# EAGLE design rev4 (EAGLE 6.6.0)
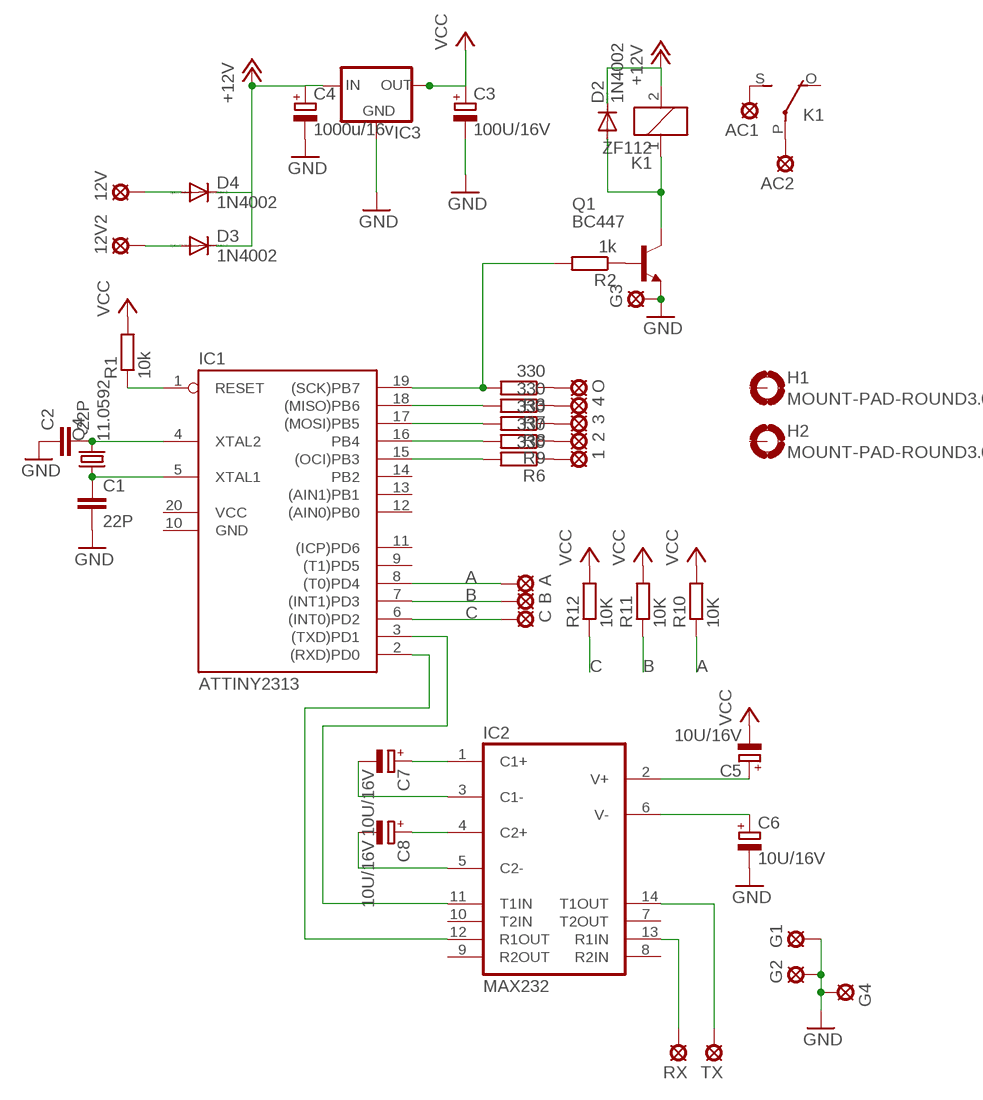
[diagram p0: schematic, sheet 1]

## Parts
1  MCS10B  [MCS10B]
2  MCS10B  [MCS10B]
3  MCS10B  [MCS10B]
4  MCS10B  [MCS10B]
12V  MCS10B  [MCS10B]
12V2  MCS10B  [MCS10B]
A  MCS10B  [MCS10B]
AC1  MCS10B  [MCS10B]
AC2  MCS10B  [MCS10B]
B  MCS10B  [MCS10B]
C  MCS10B  [MCS10B]
C1  22P  C-EU025-025X050  [C025-025X050]
C2  22P  C-EU025-025X050  [C025-025X050]
C3  100U/16V  CPOL-EUE2.5-5  [E2,5-5]
C4  1000u/16v  CPOL-EUE5-6  [E5-6]
C5  10U/16V  CPOL-EUE2.5-5  [E2,5-5]
C6  10U/16V  CPOL-EUE2.5-5  [E2,5-5]
C7  10U/16V  CPOL-EUE2.5-5  [E2,5-5]
C8  10U/16V  CPOL-EUE2.5-5  [E2,5-5]
D2  1N4002  1N4148DO35-7  [DO35-7]
D3  1N4002  1N4148DO35-7  [DO35-7]
D4  1N4002  1N4148DO35-7  [DO35-7]
G1  MCS10B  [MCS10B]
G2  MCS10B  [MCS10B]
G3  MCS10B  [MCS10B]
G4  MCS10B  [MCS10B]
H1  MOUNT-PAD-ROUND3.0  [3,0-PAD]
H2  MOUNT-PAD-ROUND3.0  [3,0-PAD]
IC1  ATTINY2313  AT90S2313P  [DIL20]
IC2  MAX232  [DIL16]
IC3  78XXS  [78XXS]
K1  ZF112  [ZF112]
O  MCS10B  [MCS10B]
Q1  BC447  [TO92-EBC]
Q4  11.0592  CRYSTALHC49S  [HC49/S]
R1  10k  R-EU_0207/7  [0207/7]
R2  1k  R-EU_0207/7  [0207/7]
R3  330  R-EU_0207/7  [0207/7]
R6  330  R-EU_0207/7  [0207/7]
R7  330  R-EU_0207/7  [0207/7]
R8  330  R-EU_0207/7  [0207/7]
R9  330  R-EU_0207/7  [0207/7]
R10  10K  R-EU_0207/7  [0207/7]
R11  10K  R-EU_0207/7  [0207/7]
R12  10K  R-EU_0207/7  [0207/7]
RX  MCS10B  [MCS10B]
TX  MCS10B  [MCS10B]

## Nets
+12V: C4.+ D2.C D3.C D4.C IC3.IN K1.2
A: A.MP IC1.8((T0)PD4) R10.1
B: B.MP IC1.7((INT1)PD3) R11.1
C: C.MP IC1.6((INT0)PD2) R12.1
GND: C1.2 C2.1 C3.- C4.- C6.- G1.MP G2.MP G3.MP G4.MP IC3.GND Q1.E
MISO: IC1.18((MISO)PB6) R7.2
MOSI: IC1.17((MOSI)PB5) R8.2
N$1: C5.+ IC2.2(V+)
N$2: C2.2 IC1.4(XTAL2) Q4.2
N$3: C1.1 IC1.5(XTAL1) Q4.1
N$4: 12V2.MP D3.A
N$5: Q1.B R2.1
N$6: C6.+ IC2.6(V-)
N$7: IC2.14(T1OUT) TX.MP
N$8: D2.A K1.1 Q1.C
N$9: IC1.15((OCI)PB3) R6.2
N$10: IC2.13(R1IN) RX.MP
N$11: IC1.3((TXD)PD1) IC2.11(T1IN)
N$12: IC1.2((RXD)PD0) IC2.12(R1OUT)
N$13: AC2.MP K1.P(2:P)
N$14: AC1.MP K1.S(2:S)
N$15: 12V.MP D4.A
N$16: IC1.16(PB4) R9.2
N$17: 1.MP R6.1
N$18: 2.MP R9.1
N$19: 3.MP R8.1
N$20: 4.MP R7.1
N$21: C7.+ IC2.1(C1+)
N$22: O.MP R3.1
N$23: C8.+ IC2.4(C2+)
N$24: C7.- IC2.3(C1-)
N$25: C8.- IC2.5(C2-)
RESET: IC1.1(RESET) R1.1
SCK: IC1.19((SCK)PB7) R2.2 R3.2
VCC: C3.+ C5.- IC3.OUT R1.2 R10.2 R11.2 R12.2
Unconnected: H1.B3,0(MOUNT) H2.B3,0(MOUNT) IC1.9((T1)PD5) IC1.11((ICP)PD6) IC1.12((AIN0)PB0) IC1.13((AIN1)PB1) IC1.14(PB2) IC2.7(T2OUT) IC2.8(R2IN) IC2.9(R2OUT) IC2.10(T2IN) K1.O(2:O)

## Power pins joined to a net without a drawn wire
GND: IC1.10(GND) IC2.15(GND)
VCC: IC1.20(VCC) IC2.16(VCC)

## Library data of the parts
1-4 12V 12V2 A AC1 AC2 B C G1-G4 O RX TX = solpad:MCS10B: SOLDER PAD MC S1, distributor Buerklin, 15F505
C1 C2 = rcl:C-EU: CAPACITOR, European symbol
C3-C8 = rcl:CPOL-EU: POLARIZED CAPACITOR, European symbol
D2-D4 = diode:1N4148: DIODE high speed (Philips)
H1 H2 = holes:MOUNT-PAD-ROUND: MOUNTING PAD, round
IC1 = atmel:AT90S2313: MICROCONTROLLER 2 Kbytes FLASH 128 bytes SRAM 128 bytes EEPROM UART; OC_FARNELL: unknown; OC_NEWARK: unknown
IC2 = maxim:MAX232: RS232 TRANSCEIVER; MF: MAXIM; MPN: MAX232ACPE+; OC_FARNELL: 9723773; OC_NEWARK: 68K4544
IC3 = v-reg:78XXS: VOLTAGE REGULATOR
K1 = relay:ZF112: RELAY 1 x switch; OC_FARNELL: unknown; OC_NEWARK: unknown
Q1 = transistor-npn:BC447*: NPN Transistor
Q4 = crystal:CRYSTAL: CRYSTAL; OC_FARNELL: 1667008; OC_NEWARK: unknown
R1-R3 R6-R12 = rcl:R-EU_: RESISTOR, European symbol

## Board
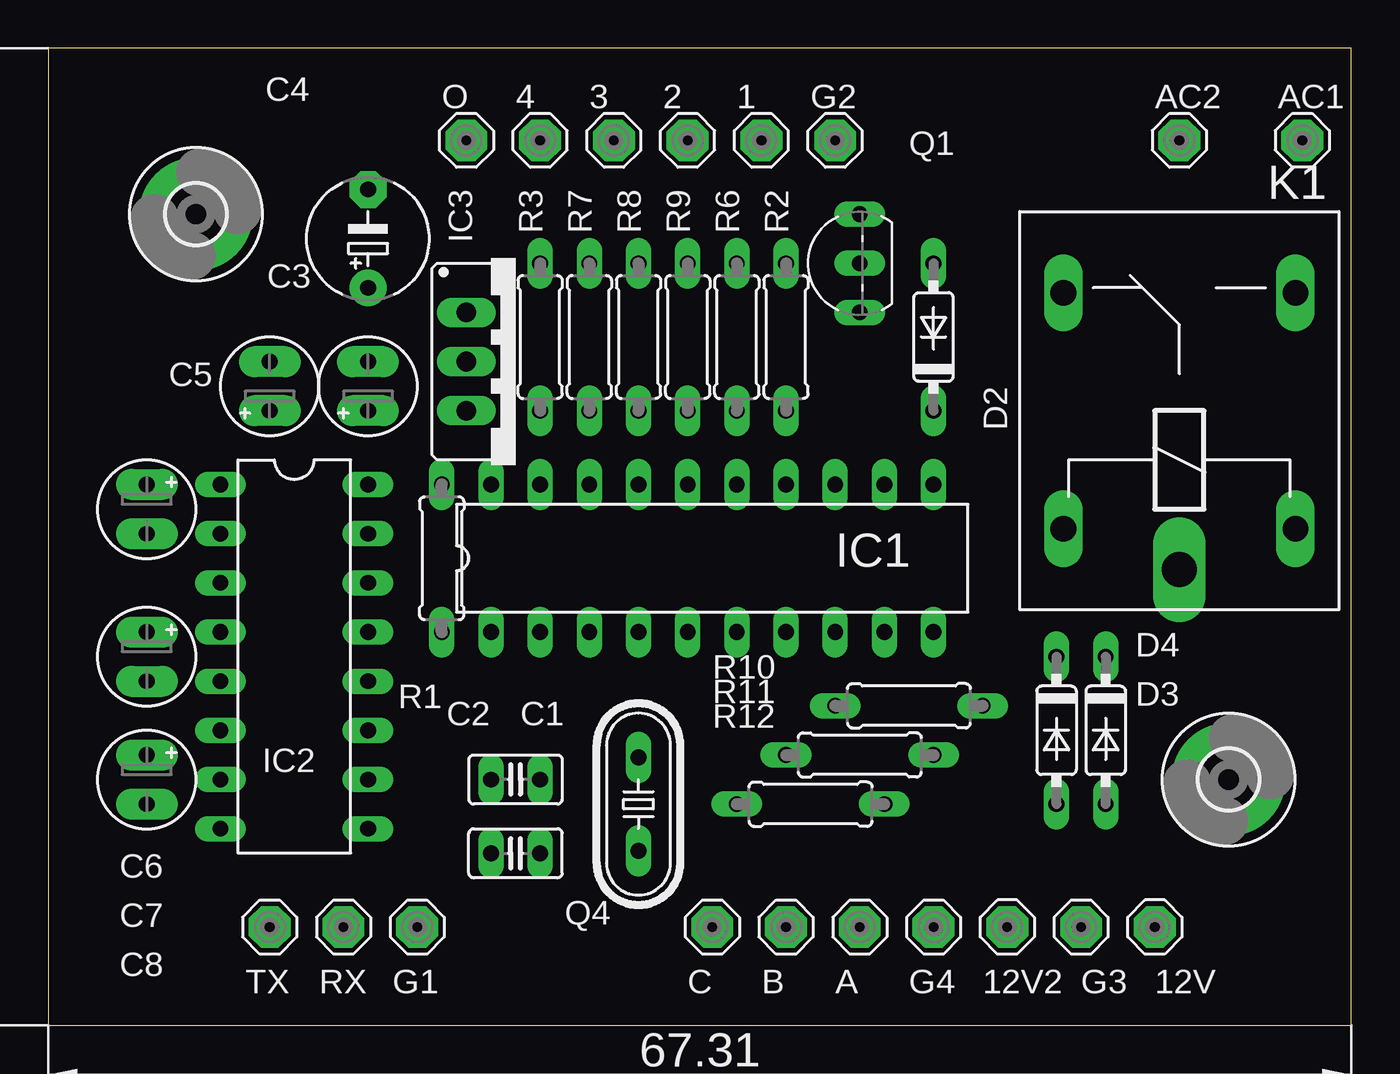
[diagram p1: board, top side]
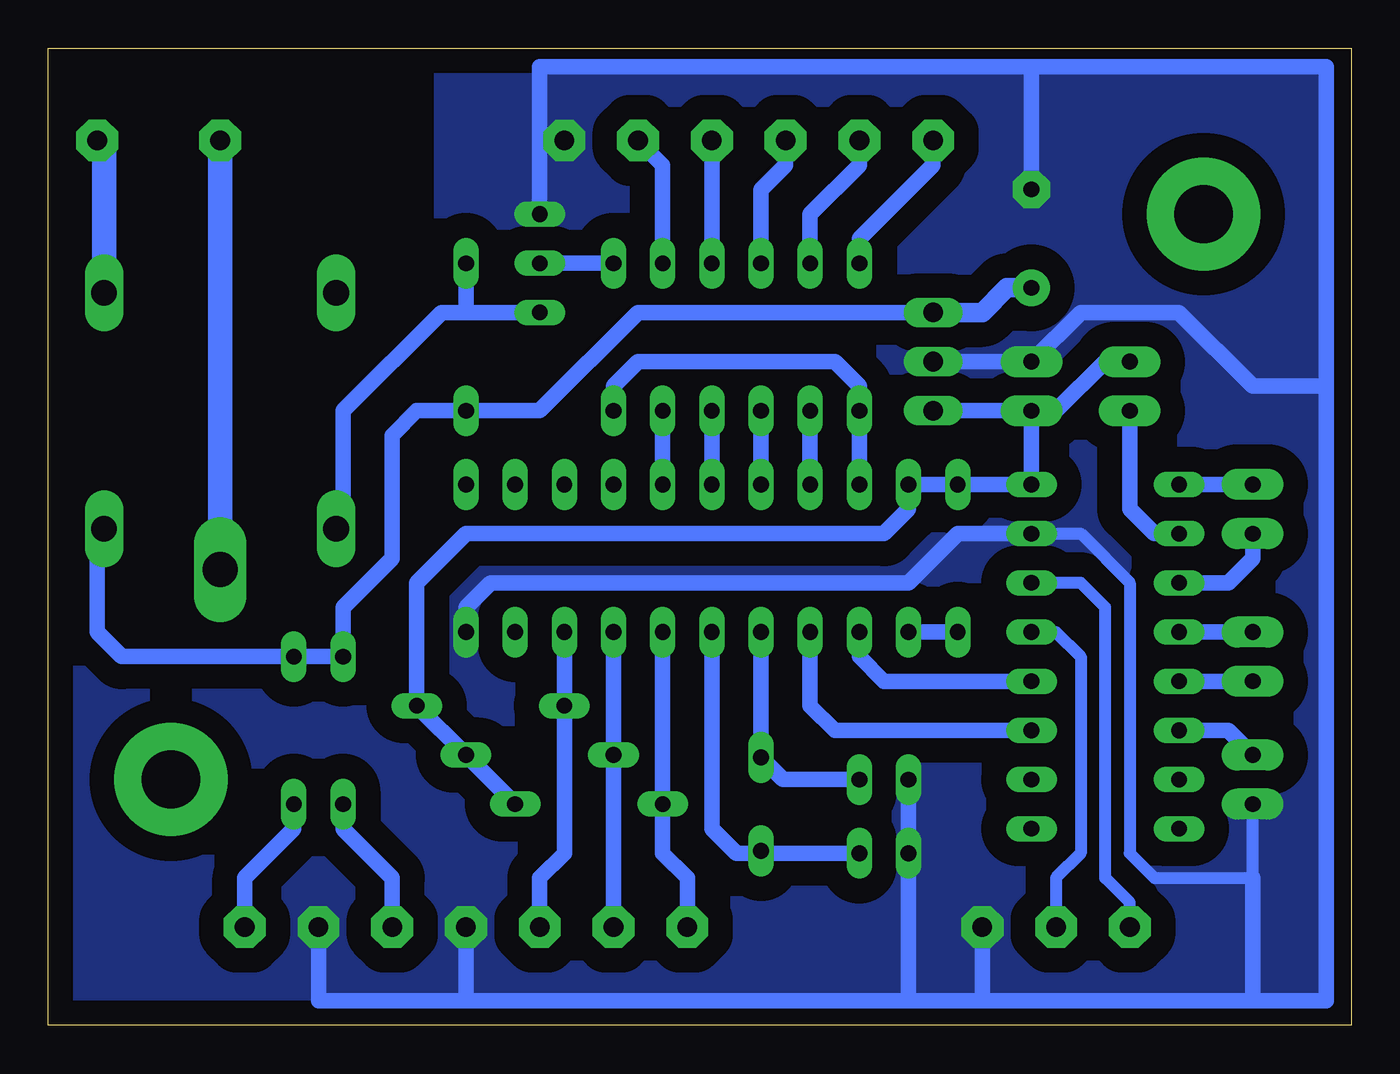
[diagram p2: board, bottom side, seen from below]

Size 67.29 x 50.47 mm. Coordinates in mm from the lower left corner, seen from the top.
Outline: 0,0 67.29,0 67.29,50.47 0,50.47 0,0
Copper layers (1*16): Top 0.035mm / dielectric 1.5mm / Bottom 0.035mm
Design rules "default": minimum track width 10mil, minimum drill 24mil, track to track 8mil, track to pad 8mil, pad to pad 8mil, via to via 8mil, smd to smd 8mil, copper to edge 40mil, drill to drill 8mil, minimum pad ring 10mil, minimum via ring 8mil, stop-mask expansion 4mil, vias tented up to drill 0mil, thermal gap 10mil

### Footprints (pad centres in the part's own frame; a part is rotated, then mirrored left to right if it is on the bottom)
MCS10B = drill 1.016 pad 2.159 octagon: MP 0,0
C025-025X050 = drill 0.813 long: 1 -1.27,0; 2 1.27,0
E2,5-5 = drill 0.813 pad 1.6 long: + -1.27,0; - 1.27,0
E5-6 = drill 0.813 pad 1.905: + -2.54,0 | drill 0.813 pad 1.905 octagon: - 2.54,0
DO35-7 = drill 0.813 long: A 3.81,0; C -3.81,0
3,0-PAD = drill 3 pad 5.842: B3,0 0,0
DIL20 = drill 0.813 long: 1 -11.43,-3.81; 2 -8.89,-3.81; 3 -6.35,-3.81; 4 -3.81,-3.81; 5 -1.27,-3.81; 6 1.27,-3.81; 7 3.81,-3.81; 8 6.35,-3.81; 9 8.89,-3.81; 10 11.43,-3.81; 11 11.43,3.81; 12 8.89,3.81; 13 6.35,3.81; 14 3.81,3.81; 15 1.27,3.81; 16 -1.27,3.81; 17 -3.81,3.81; 18 -6.35,3.81; 19 -8.89,3.81; 20 -11.43,3.81
DIL16 = drill 0.813 long: 1 -8.89,-3.81; 2 -6.35,-3.81; 3 -3.81,-3.81; 4 -1.27,-3.81; 5 1.27,-3.81; 6 3.81,-3.81; 7 6.35,-3.81; 8 8.89,-3.81; 9 8.89,3.81; 10 6.35,3.81; 11 3.81,3.81; 12 1.27,3.81; 13 -1.27,3.81; 14 -3.81,3.81; 15 -6.35,3.81; 16 -8.89,3.81
78XXS = drill 1.016 long: GND 0,-2.54; IN -2.54,-2.54; OUT 2.54,-2.54
ZF112 = drill 1.321 long: 1 -6.096,5.994; 2 -6.096,-5.994; O 6.096,5.994; S 6.096,-5.994 | drill 1.803 long: P -8.204,0
TO92-EBC = drill 0.813 long: B 0,-1.27; C -2.54,-1.27; E 2.54,-1.27
HC49/S = drill 0.813 long: 1 -2.413,0; 2 2.413,0
0207/7 = drill 0.813 long: 1 -3.81,0; 2 3.81,0

### Placement (x,y rotation side)
1  36.83,45.72 180 top
2  33.02,45.72 180 top
3  29.21,45.72 180 top
4  25.4,45.72 180 top
12V  57.15,5.08 270 top
12V2  49.53,5.08 270 top
A  41.91,5.08 0 top
AC1  64.77,45.72 0 top
AC2  58.42,45.72 0 top
B  38.1,5.08 0 top
C  34.29,5.08 0 top
C1  24.13,8.89 180 top
C2  24.13,12.7 0 top
C3  16.51,33.02 90 top
C4  16.51,40.64 90 top
C5  11.43,33.02 90 top
C6  5.08,12.7 270 top
C7  5.08,26.67 270 top
C8  5.08,19.05 270 top
D2  45.72,35.56 90 top
D3  52.07,15.24 270 top
D4  54.61,15.24 270 top
G1  19.05,5.08 0 top
G2  40.64,45.72 180 top
G3  53.34,5.08 0 top
G4  45.72,5.08 0 top
H1  7.62,41.91 0 top
H2  60.96,12.7 0 top
IC1  34.29,24.13 0 top
IC2  12.7,19.05 270 top
IC3  24.13,34.29 270 top
K1  58.42,31.75 90 top
O  21.59,45.72 0 top
Q1  40.64,39.37 90 top
Q4  30.48,11.43 90 top
R1  20.32,24.13 90 top
R2  38.1,35.56 270 top
R3  25.4,35.56 270 top
R6  35.56,35.56 270 top
R7  27.94,35.56 270 top
R8  30.48,35.56 270 top
R9  33.02,35.56 270 top
R10  44.45,16.51 0 top
R11  41.91,13.97 0 top
R12  39.37,11.43 0 top
RX  15.24,5.08 0 top
TX  11.43,5.08 0 top

### Tracks (layer width: path | path; a pad name or v marks a point on that pad's centre or on a via)
+12V
  Bottom 0.813: IC3.IN 36.83,36.83 41.91,31.75 D2.C 48.26,31.75 49.53,30.48 49.53,24.13 52.07,21.59 D3.C D4.C 63.5,19.05 64.77,20.32 64.77,25.3 K1.2
  Bottom 1.016: IC3.IN 19.05,36.83 17.78,38.1 C4.+
A
  Bottom 0.813: IC1.8 R10.1 40.64,8.89 41.91,7.62 A.MP
B
  Bottom 0.813: IC1.7 R11.1 B.MP
C
  Bottom 0.813: IC1.6 R12.1 35.56,8.89 34.29,7.62 C.MP
GND
  Bottom 0.61: IC2.15 13.97,25.4 11.43,22.86 11.43,8.89 10.16,7.62 5.08,7.62 C6.-
  Bottom 0.813: C1.2 C2.1 22.86,1.27 | IC1.10 45.72,21.59 44.45,22.86 22.86,22.86 20.32,25.4 IC2.15 | 22.86,1.27 19.05,1.27 | 19.05,1.27 5.08,1.27 | 5.08,1.27 5.08,7.62 | IC3.GND C3.- 13.97,36.83 8.89,36.83 5.08,33.02 1.27,33.02 | Q1.E 41.91,45.72 | 41.91,45.72 41.91,49.53 16.51,49.53 | 16.51,49.53 1.27,49.53 1.27,33.02 | 1.27,33.02 1.27,1.27 5.08,1.27 | C4.- 16.51,49.53 | G3.MP 53.34,1.27 45.72,1.27 | 45.72,1.27 22.86,1.27 | G2.MP 41.91,45.72 | G1.MP 19.05,1.27 | G4.MP 45.72,1.27
  pour Bottom (isolate 1.27, no thermals): 1.27,1.27 66.04,1.27 66.04,19.05 54.61,19.05 52.07,21.59 52.07,31.75 46.99,36.83 46.99,49.53 1.27,49.53
MISO
  Bottom 0.813: IC1.18 R7.2
MOSI
  Bottom 0.813: IC1.17 R8.2
N$1
  Bottom 0.813: IC2.2 10.16,25.4 11.43,26.67 C5.+
N$2
  Bottom 0.813: IC1.4 Q4.2 29.34,12.7 C2.2
N$3
  Bottom 0.813: C1.1 30.35,8.89 Q4.1 30.61,8.89 31.75,8.89 33.02,10.16 IC1.5
N$4
  Bottom 0.813: 12V2.MP 49.53,7.62 52.07,10.16 D3.A
N$5
  Bottom 0.813: Q1.B R2.1
N$6
  Bottom 0.813: IC2.6 6.35,15.24 C6.+
N$7
  Bottom 0.61: TX.MP 11.43,6.35 12.7,7.62 12.7,21.59 13.97,22.86 IC2.14
N$8
  Bottom 0.813: Q1.C 45.72,36.83 | 45.72,36.83 46.99,36.83 52.07,31.75 52.07,26.01 K1.1 | D2.A 45.72,36.83
N$9
  Bottom 0.813: IC1.15 R6.2
N$10
  Bottom 0.61: IC2.13 15.24,20.32 13.97,19.05 13.97,8.89 15.24,7.62 RX.MP
N$11
  Bottom 0.813: IC2.11 26.67,15.24 27.94,16.51 IC1.3
N$12
  Bottom 0.813: IC2.12 24.13,17.78 25.4,19.05 IC1.2
N$13
  Bottom 1.27: K1.P AC2.MP
N$14
  Bottom 0.813: 64.41,45.36 AC1.MP
  Bottom 1.27: K1.S 64.41,45.36
N$15
  Bottom 0.813: 12V.MP 57.15,7.62 54.61,10.16 D4.A
N$16
  Bottom 0.813: IC1.16 R9.2
N$17
  Bottom 0.813: R6.1 35.56,44.45 1.MP
N$18
  Bottom 0.813: R9.1 2.MP
N$19
  Bottom 0.813: R8.1 30.48,43.18 29.21,44.45 3.MP
N$20
  Bottom 0.813: R7.1 27.94,41.91 25.4,44.45 4.MP
N$21
  Bottom 0.813: IC2.1 C7.+
N$22
  Bottom 0.813: R3.1 25.4,40.64 21.59,44.45 O.MP
N$23
  Bottom 0.813: IC2.4 C8.+
N$24
  Bottom 0.813: IC2.3 6.35,22.86 5.08,24.13 C7.-
N$25
  Bottom 0.813: IC2.5 C8.-
RESET
  Bottom 0.813: R1.1 IC1.1
SCK
  Bottom 0.813: IC1.19 R3.2 25.4,33.02 26.67,34.29 36.83,34.29 38.1,33.02 R2.2
VCC
  Bottom 0.813: C5.- 12.7,34.29 15.24,31.75 C3.+ | R12.2 R11.2 R10.2 48.26,22.86 45.72,25.4 24.13,25.4 22.86,26.67 IC1.20 R1.2 IC2.16 C3.+ | IC3.OUT C3.+